# EAGLE design MainBoard (EAGLE 9.6.2)
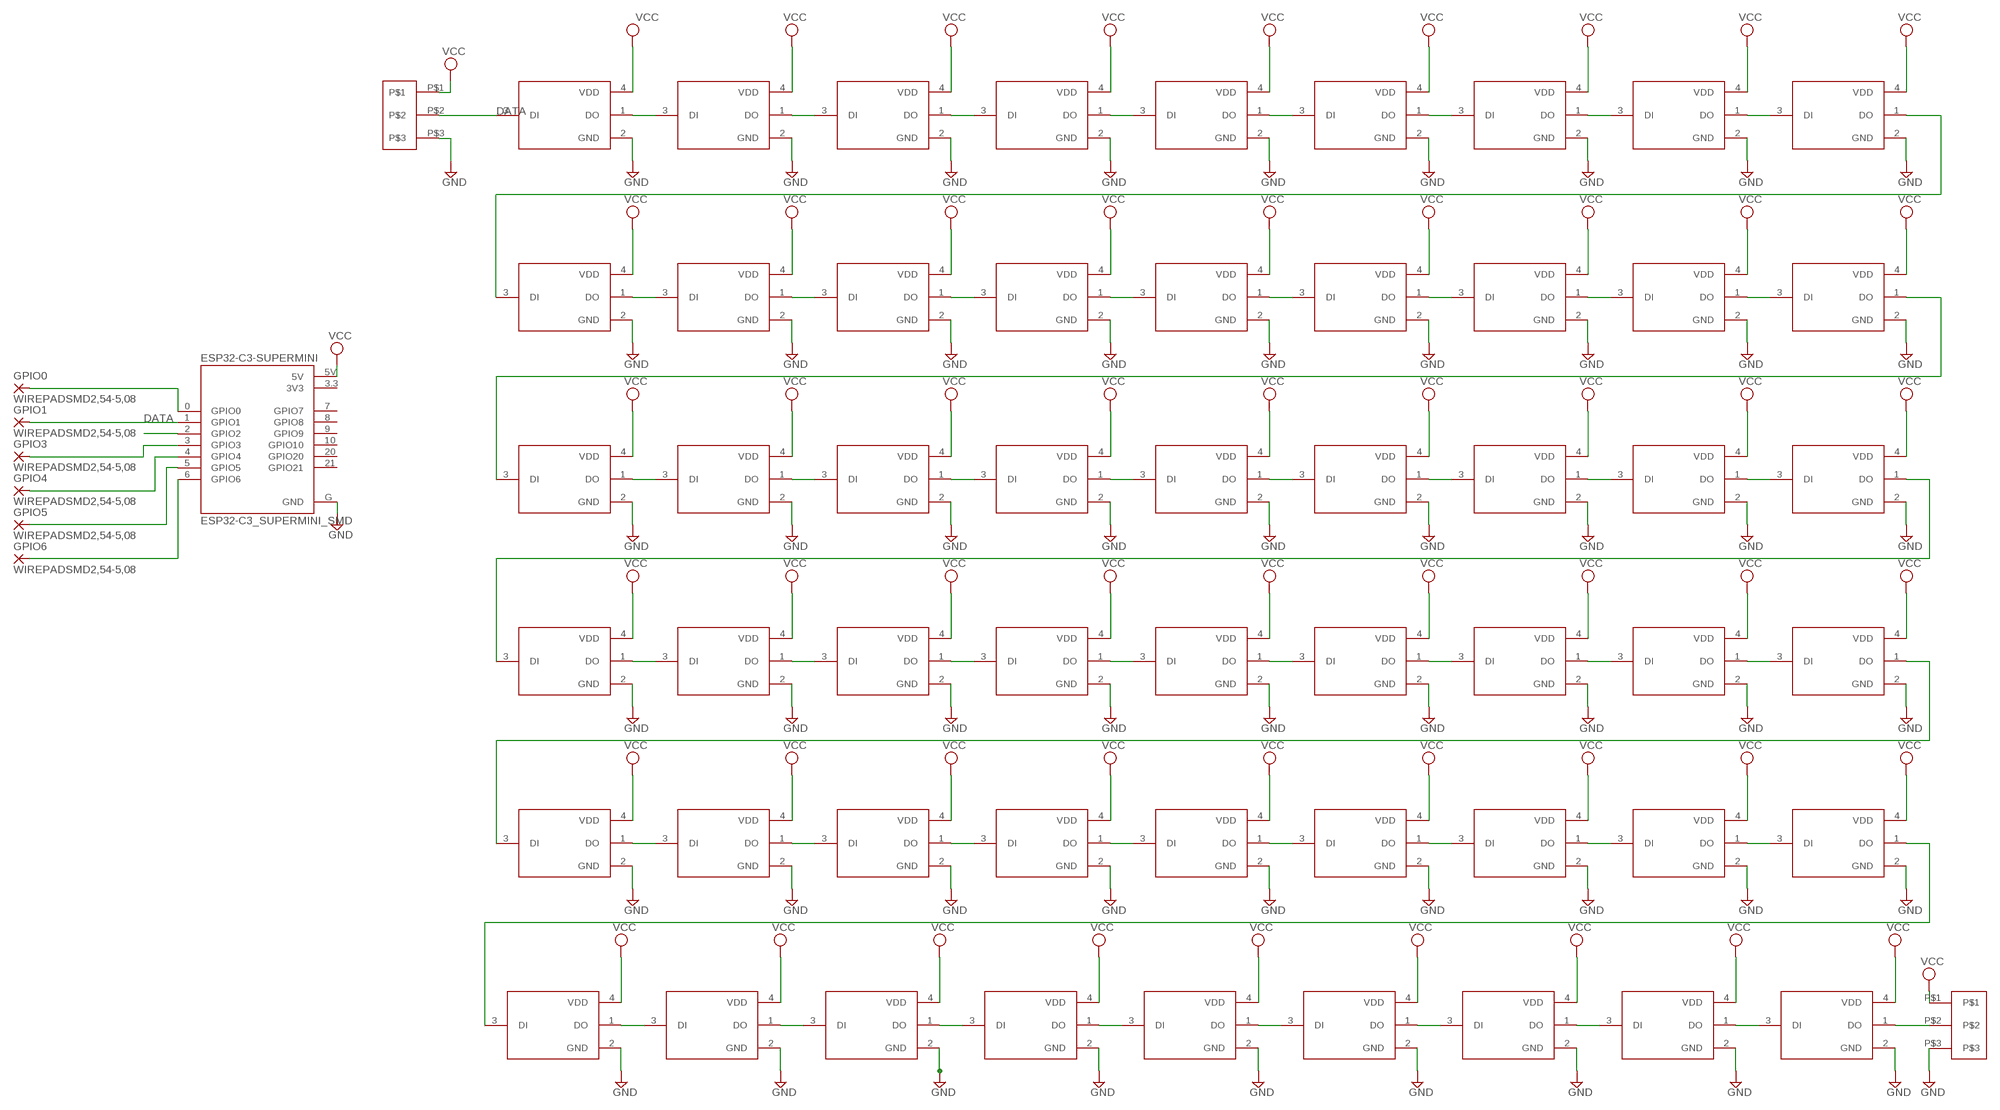
[diagram p0: schematic, sheet 1]

## Parts
ESP32-C3-SUPERMINI  ESP32-C3_SUPERMINI_SMD  [MODULE_ESP32-C3_SUPERMINI]
GPIO0  WIREPADSMD2,54-5,08  [SMD2,54-5,08]
GPIO1  WIREPADSMD2,54-5,08  [SMD2,54-5,08]
GPIO3  WIREPADSMD2,54-5,08  [SMD2,54-5,08]
GPIO4  WIREPADSMD2,54-5,08  [SMD2,54-5,08]
GPIO5  WIREPADSMD2,54-5,08  [SMD2,54-5,08]
GPIO6  WIREPADSMD2,54-5,08  [SMD2,54-5,08]
LED1  WS2812B2020  [LED_WS2812B2020]
LED2  WS2812B2020  [LED_WS2812B2020]
LED3  WS2812B2020  [LED_WS2812B2020]
LED4  WS2812B2020  [LED_WS2812B2020]
LED5  WS2812B2020  [LED_WS2812B2020]
LED6  WS2812B2020  [LED_WS2812B2020]
LED7  WS2812B2020  [LED_WS2812B2020]
LED8  WS2812B2020  [LED_WS2812B2020]
LED9  WS2812B2020  [LED_WS2812B2020]
LED10  WS2812B2020  [LED_WS2812B2020]
LED11  WS2812B2020  [LED_WS2812B2020]
LED12  WS2812B2020  [LED_WS2812B2020]
LED13  WS2812B2020  [LED_WS2812B2020]
LED14  WS2812B2020  [LED_WS2812B2020]
LED15  WS2812B2020  [LED_WS2812B2020]
LED16  WS2812B2020  [LED_WS2812B2020]
LED17  WS2812B2020  [LED_WS2812B2020]
LED18  WS2812B2020  [LED_WS2812B2020]
LED19  WS2812B2020  [LED_WS2812B2020]
LED20  WS2812B2020  [LED_WS2812B2020]
LED21  WS2812B2020  [LED_WS2812B2020]
LED22  WS2812B2020  [LED_WS2812B2020]
LED23  WS2812B2020  [LED_WS2812B2020]
LED24  WS2812B2020  [LED_WS2812B2020]
LED25  WS2812B2020  [LED_WS2812B2020]
LED26  WS2812B2020  [LED_WS2812B2020]
LED27  WS2812B2020  [LED_WS2812B2020]
LED28  WS2812B2020  [LED_WS2812B2020]
LED29  WS2812B2020  [LED_WS2812B2020]
LED30  WS2812B2020  [LED_WS2812B2020]
LED31  WS2812B2020  [LED_WS2812B2020]
LED32  WS2812B2020  [LED_WS2812B2020]
LED33  WS2812B2020  [LED_WS2812B2020]
LED34  WS2812B2020  [LED_WS2812B2020]
LED35  WS2812B2020  [LED_WS2812B2020]
LED36  WS2812B2020  [LED_WS2812B2020]
LED37  WS2812B2020  [LED_WS2812B2020]
LED38  WS2812B2020  [LED_WS2812B2020]
LED39  WS2812B2020  [LED_WS2812B2020]
LED40  WS2812B2020  [LED_WS2812B2020]
LED41  WS2812B2020  [LED_WS2812B2020]
LED42  WS2812B2020  [LED_WS2812B2020]
LED43  WS2812B2020  [LED_WS2812B2020]
LED44  WS2812B2020  [LED_WS2812B2020]
LED45  WS2812B2020  [LED_WS2812B2020]
LED46  WS2812B2020  [LED_WS2812B2020]
LED47  WS2812B2020  [LED_WS2812B2020]
LED48  WS2812B2020  [LED_WS2812B2020]
LED49  WS2812B2020  [LED_WS2812B2020]
LED50  WS2812B2020  [LED_WS2812B2020]
LED51  WS2812B2020  [LED_WS2812B2020]
LED52  WS2812B2020  [LED_WS2812B2020]
LED53  WS2812B2020  [LED_WS2812B2020]
LED54  WS2812B2020  [LED_WS2812B2020]
U$1  POGO-3-M  [POGO-3-M]
U$2  POGO-3-F  [POGO-3-F]

## Nets
DATA: ESP32-C3-SUPERMINI.2(GPIO2) LED1.3(DI) U$2.P$2
GND: ESP32-C3-SUPERMINI.G(GND) LED1.2(GND) LED2.2(GND) LED3.2(GND) LED4.2(GND) LED5.2(GND) LED6.2(GND) LED7.2(GND) LED8.2(GND) LED9.2(GND) LED10.2(GND) LED11.2(GND) LED12.2(GND) LED13.2(GND) LED14.2(GND) LED15.2(GND) LED16.2(GND) LED17.2(GND) LED18.2(GND) LED19.2(GND) LED20.2(GND) LED21.2(GND) LED22.2(GND) LED23.2(GND) LED24.2(GND) LED25.2(GND) LED26.2(GND) LED27.2(GND) LED28.2(GND) LED29.2(GND) LED30.2(GND) LED31.2(GND) LED32.2(GND) LED33.2(GND) LED34.2(GND) LED35.2(GND) LED36.2(GND) LED37.2(GND) LED38.2(GND) LED39.2(GND) LED40.2(GND) LED41.2(GND) LED42.2(GND) LED43.2(GND) LED44.2(GND) LED45.2(GND) LED46.2(GND) LED47.2(GND) LED48.2(GND) LED49.2(GND) LED50.2(GND) LED51.2(GND) LED52.2(GND) LED53.2(GND) LED54.2(GND) U$1.P$3 U$2.P$3
N$1: LED1.1(DO) LED2.3(DI)
N$2: LED2.1(DO) LED3.3(DI)
N$3: LED3.1(DO) LED4.3(DI)
N$4: LED4.1(DO) LED5.3(DI)
N$5: LED5.1(DO) LED6.3(DI)
N$6: LED6.1(DO) LED7.3(DI)
N$7: LED7.1(DO) LED8.3(DI)
N$8: LED8.1(DO) LED9.3(DI)
N$9: LED9.1(DO) LED10.3(DI)
N$10: LED10.1(DO) LED11.3(DI)
N$11: LED11.1(DO) LED12.3(DI)
N$12: LED12.1(DO) LED13.3(DI)
N$13: LED13.1(DO) LED14.3(DI)
N$14: LED14.1(DO) LED15.3(DI)
N$15: LED15.1(DO) LED16.3(DI)
N$16: LED16.1(DO) LED17.3(DI)
N$17: LED17.1(DO) LED18.3(DI)
N$18: LED18.1(DO) LED19.3(DI)
N$19: LED19.1(DO) LED20.3(DI)
N$20: LED20.1(DO) LED21.3(DI)
N$21: LED21.1(DO) LED22.3(DI)
N$22: LED22.1(DO) LED23.3(DI)
N$23: LED23.1(DO) LED24.3(DI)
N$24: LED24.1(DO) LED25.3(DI)
N$25: LED25.1(DO) LED26.3(DI)
N$26: LED26.1(DO) LED27.3(DI)
N$27: LED27.1(DO) LED28.3(DI)
N$28: LED28.1(DO) LED29.3(DI)
N$29: LED29.1(DO) LED30.3(DI)
N$30: LED30.1(DO) LED31.3(DI)
N$31: LED31.1(DO) LED32.3(DI)
N$32: LED32.1(DO) LED33.3(DI)
N$33: LED33.1(DO) LED34.3(DI)
N$34: LED34.1(DO) LED35.3(DI)
N$35: LED35.1(DO) LED36.3(DI)
N$36: LED36.1(DO) LED37.3(DI)
N$37: LED37.1(DO) LED38.3(DI)
N$38: LED38.1(DO) LED39.3(DI)
N$39: LED39.1(DO) LED40.3(DI)
N$40: LED40.1(DO) LED41.3(DI)
N$41: LED41.1(DO) LED42.3(DI)
N$42: LED42.1(DO) LED43.3(DI)
N$43: LED43.1(DO) LED44.3(DI)
N$44: LED44.1(DO) LED45.3(DI)
N$45: LED45.1(DO) LED46.3(DI)
N$46: LED46.1(DO) LED47.3(DI)
N$47: LED47.1(DO) LED48.3(DI)
N$48: LED48.1(DO) LED49.3(DI)
N$49: LED49.1(DO) LED50.3(DI)
N$50: LED50.1(DO) LED51.3(DI)
N$51: LED51.1(DO) LED52.3(DI)
N$52: LED52.1(DO) LED53.3(DI)
N$53: LED53.1(DO) LED54.3(DI)
N$54: LED54.1(DO) U$1.P$2
N$55: ESP32-C3-SUPERMINI.0(GPIO0) GPIO0.1(P)
N$56: ESP32-C3-SUPERMINI.1(GPIO1) GPIO1.1(P)
N$57: ESP32-C3-SUPERMINI.6(GPIO6) GPIO6.1(P)
N$58: ESP32-C3-SUPERMINI.5(GPIO5) GPIO5.1(P)
N$59: ESP32-C3-SUPERMINI.4(GPIO4) GPIO4.1(P)
N$60: ESP32-C3-SUPERMINI.3(GPIO3) GPIO3.1(P)
VCC: ESP32-C3-SUPERMINI.5V LED1.4(VDD) LED2.4(VDD) LED3.4(VDD) LED4.4(VDD) LED5.4(VDD) LED6.4(VDD) LED7.4(VDD) LED8.4(VDD) LED9.4(VDD) LED10.4(VDD) LED11.4(VDD) LED12.4(VDD) LED13.4(VDD) LED14.4(VDD) LED15.4(VDD) LED16.4(VDD) LED17.4(VDD) LED18.4(VDD) LED19.4(VDD) LED20.4(VDD) LED21.4(VDD) LED22.4(VDD) LED23.4(VDD) LED24.4(VDD) LED25.4(VDD) LED26.4(VDD) LED27.4(VDD) LED28.4(VDD) LED29.4(VDD) LED30.4(VDD) LED31.4(VDD) LED32.4(VDD) LED33.4(VDD) LED34.4(VDD) LED35.4(VDD) LED36.4(VDD) LED37.4(VDD) LED38.4(VDD) LED39.4(VDD) LED40.4(VDD) LED41.4(VDD) LED42.4(VDD) LED43.4(VDD) LED44.4(VDD) LED45.4(VDD) LED46.4(VDD) LED47.4(VDD) LED48.4(VDD) LED49.4(VDD) LED50.4(VDD) LED51.4(VDD) LED52.4(VDD) LED53.4(VDD) LED54.4(VDD) U$1.P$1 U$2.P$1
Unconnected: ESP32-C3-SUPERMINI.7(GPIO7) ESP32-C3-SUPERMINI.8(GPIO8) ESP32-C3-SUPERMINI.9(GPIO9) ESP32-C3-SUPERMINI.10(GPIO10) ESP32-C3-SUPERMINI.20(GPIO20) ESP32-C3-SUPERMINI.21(GPIO21)

## Power pins joined to a net without a drawn wire
3V3: ESP32-C3-SUPERMINI.3.3(3V3)

## Library data of the parts
ESP32-C3-SUPERMINI = ESP32-C3_SUPERMINI_SMD:ESP32-C3_SUPERMINI_SMD: Check availability <https://pricing.snapeda.com/parts/ESP32-C3%20SuperMini_SMD/Espressif%20Systems/view-part?ref=eda>; AVAILABILITY: Not in stock; CHECK_PRICES: https://www.snapeda.com/parts/ESP32-C3%20SuperMini_SMD/Espressif+Systems/view-part/?ref=eda; DESCRIPTION: Super tiny ESP32-C3 board; MF: Espressif Systems; MP: ESP32-C3 SuperMini_SMD; PACKAGE: None; PRICE: None; SNAPEDA_LINK: https://www.snapeda.com/parts/ESP32-C3%20SuperMini_SMD/Espressif+Systems/view-part/?ref=snap
GPIO0 GPIO1 GPIO3-GPIO6 = wirepad:WIREPAD: Wire PAD connect wire on PCB
LED1-LED54 = WS2812B2020:WS2812B2020: Check availability <https://pricing.snapeda.com/parts/WS2812B2020/WorldSemi/view-part?ref=eda>; AVAILABILITY: Not in stock; CHECK_PRICES: https://www.snapeda.com/parts/WS2812B2020/Worldsemi/view-part/?ref=eda; DESCRIPTION: LED; SMD; 2020; RGB; 2x2x0.84mm; 3.7÷5.3V; Lens: transparent; 2kHz; MF: WorldSemi; MP: WS2812B2020; PACKAGE: None; PRICE: None; SNAPEDA_LINK: https://www.snapeda.com/parts/WS2812B2020/Worldsemi/view-part/?ref=snap
U$1 = untitled:POGO-3-M
U$2 = untitled:POGO-3-F

## Board
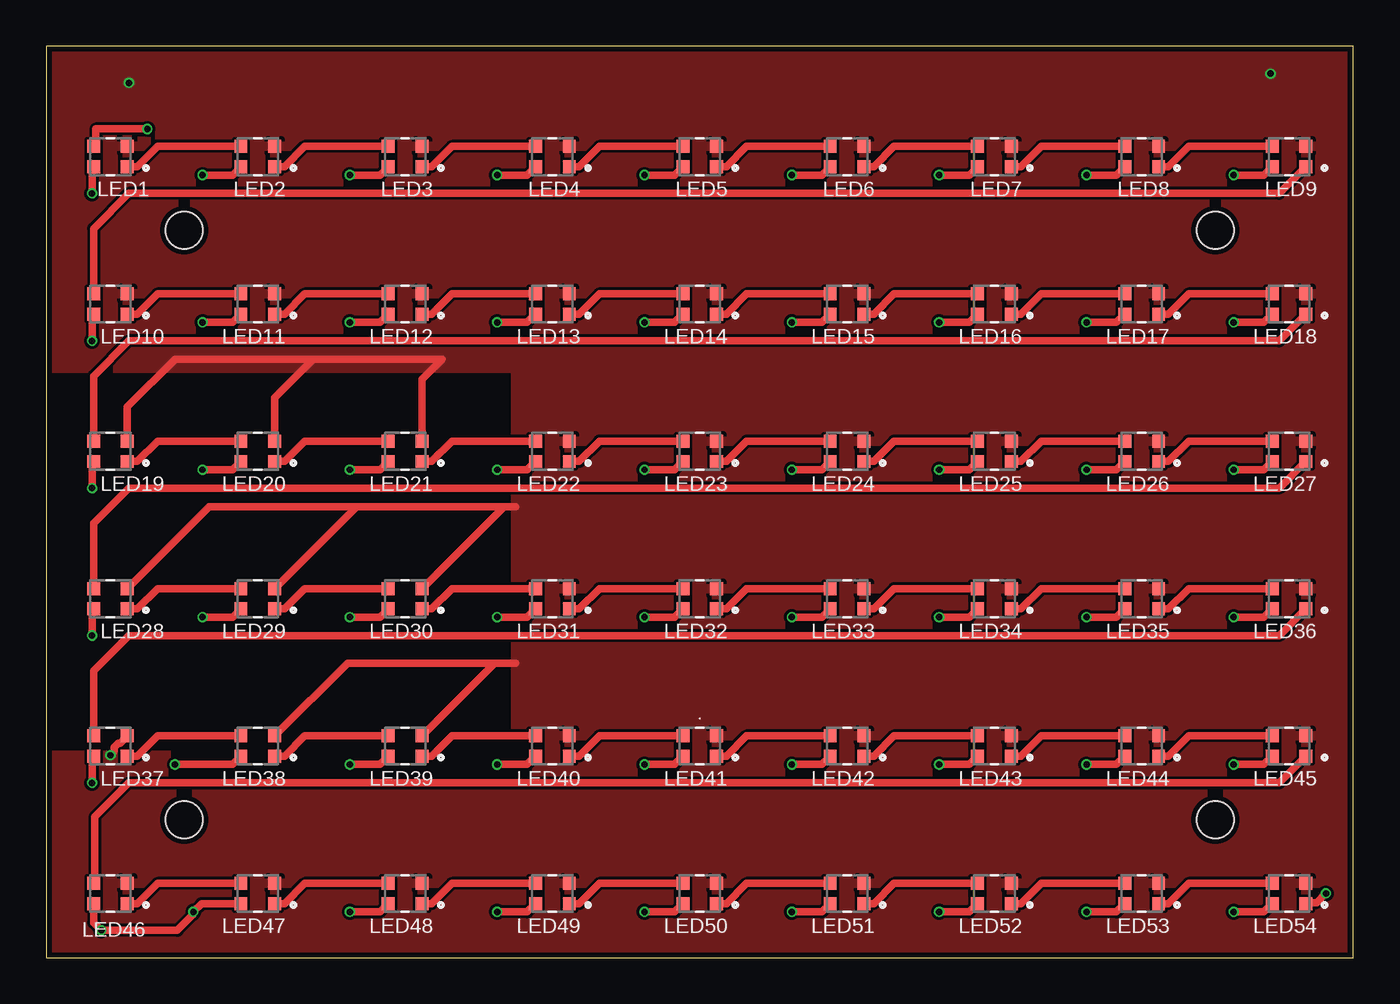
[diagram p1: board, top side]
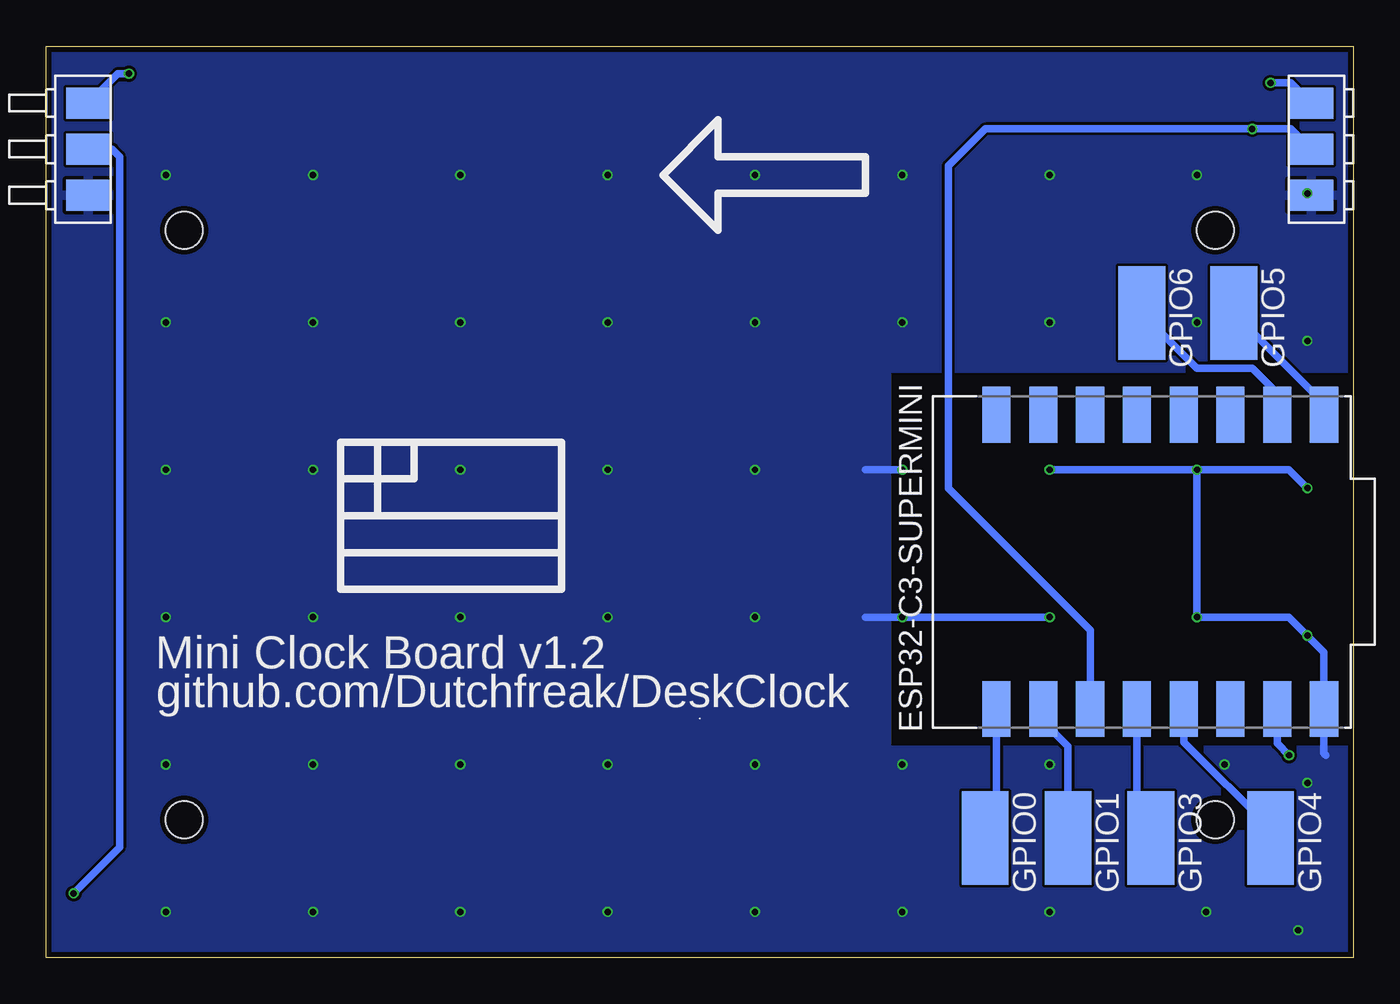
[diagram p2: board, bottom side, seen from below]

Size 71 x 49.5 mm. Coordinates in mm from the lower left corner, seen from the top.
Outline: 0,0 71,0 71,49.5 0,49.5 0,0
Copper layers (1*16): Top 0.035mm / dielectric 1.5mm / Bottom 0.035mm
Design rules "PCBWay_2L_152um-Track": minimum track width 6mil, minimum drill 0.3mm, track to track 6mil, track to pad 6mil, pad to pad 6mil, via to via 6mil, smd to smd 0mil, copper to edge 0.3mm, drill to drill 10mil, minimum pad ring 6mil, minimum via ring 0.1mm, stop-mask expansion 2mil, vias tented up to drill 0.45mm, thermal gap 0.2mm
Holes 2 mm at 7.5,39.5 7.5,7.5 63.5,7.5 63.5,39.5

### Footprints (pad centres in the part's own frame; a part is rotated, then mirrored left to right if it is on the bottom)
MODULE_ESP32-C3_SUPERMINI = smd 3.025 x 1.524: 0 7.985,-7.88; 1 7.985,-5.34; 2 7.985,-2.8; 3 7.985,-0.26; 3.3 7.985,4.82; 4 7.985,2.28; 5 -7.985,9.9; 5V 7.985,9.9; 6 -7.985,7.36; 7 -7.985,4.82; 8 -7.985,2.28; 9 -7.985,-0.26; 10 -7.985,-2.8; 20 -7.985,-5.34; 21 -7.985,-7.88; G 7.985,7.36
SMD2,54-5,08 = smd 2.54 x 5.08: 1 0,0
LED_WS2812B2020 = smd 0.7 x 0.7: 1 -0.915,0.55; 2 -0.915,-0.55; 3 0.915,-0.55; 4 0.915,0.55
POGO-3-M = smd 2.4 x 1.7: P$1 0,2.5; P$2 0,0; P$3 0,-2.5
POGO-3-F = smd 2.4 x 1.7: P$1 0,2.5; P$2 0,0; P$3 0,-2.5

### Placement (x,y rotation side)
ESP32-C3-SUPERMINI  11.5,21.5 270 bottom
GPIO0  20,6.5 180 bottom
GPIO1  15.5,6.5 180 bottom
GPIO3  11,6.5 180 bottom
GPIO4  4.5,6.5 180 bottom
GPIO5  6.5,35 180 bottom
GPIO6  11.5,35 180 bottom
LED1  3.5,43.5 180 top
LED2  11.5,43.5 180 top
LED3  19.5,43.5 180 top
LED4  27.5,43.5 180 top
LED5  35.5,43.5 180 top
LED6  43.5,43.5 180 top
LED7  51.5,43.5 180 top
LED8  59.5,43.5 180 top
LED9  67.5,43.5 180 top
LED10  3.5,35.5 180 top
LED11  11.5,35.5 180 top
LED12  19.5,35.5 180 top
LED13  27.5,35.5 180 top
LED14  35.5,35.5 180 top
LED15  43.5,35.5 180 top
LED16  51.5,35.5 180 top
LED17  59.5,35.5 180 top
LED18  67.5,35.5 180 top
LED19  3.5,27.5 180 top
LED20  11.5,27.5 180 top
LED21  19.5,27.5 180 top
LED22  27.5,27.5 180 top
LED23  35.5,27.5 180 top
LED24  43.5,27.5 180 top
LED25  51.5,27.5 180 top
LED26  59.5,27.5 180 top
LED27  67.5,27.5 180 top
LED28  3.5,19.5 180 top
LED29  11.5,19.5 180 top
LED30  19.5,19.5 180 top
LED31  27.5,19.5 180 top
LED32  35.5,19.5 180 top
LED33  43.5,19.5 180 top
LED34  51.5,19.5 180 top
LED35  59.5,19.5 180 top
LED36  67.5,19.5 180 top
LED37  3.5,11.5 180 top
LED38  11.5,11.5 180 top
LED39  19.5,11.5 180 top
LED40  27.5,11.5 180 top
LED41  35.5,11.5 180 top
LED42  43.5,11.5 180 top
LED43  51.5,11.5 180 top
LED44  59.5,11.5 180 top
LED45  67.5,11.5 180 top
LED46  3.5,3.5 180 top
LED47  11.5,3.5 180 top
LED48  19.5,3.5 180 top
LED49  27.5,3.5 180 top
LED50  35.5,3.5 180 top
LED51  43.5,3.5 180 top
LED52  51.5,3.5 180 top
LED53  59.5,3.5 180 top
LED54  67.5,3.5 180 top
U$1  68.7,43.9 180 bottom
U$2  2.3,43.9 180 bottom

### Tracks (layer width: path | path; a pad name or v marks a point on that pad's centre or on a via)
DATA  (via drill 0.35)
  Top 0.406: LED1.3 2.7,44.17 2.7,45 v5.5,45
  Bottom 0.406: ESP32-C3-SUPERMINI.2 14.3,17.8 22,25.5 22,43 20,45 v5.5,45 3.4,45 U$2.P$2 2.3,44.49
GND  (via drill 0.35)
  Top 0.406: LED19.2 4.41,29.91 7,32.5 14.5,32.5 | 14.5,32.5 21.5,32.5 20.41,31.41 LED21.2 | LED20.2 12.41,30.41 14.5,32.5 | LED28.2 8.87,24.5 16.86,24.5 | 24.86,24.5 16.86,24.5 | LED29.2 16.86,24.5 | LED30.2 24.86,24.5 | 24.86,24.5 25.5,24.5 | v3.5,11 3.71,11.21 3.71,11.45 3.92,11.66 4.02,11.66 LED37.2 | LED38.2 16.36,16 24.36,16 | LED39.2 24.36,16 | 24.36,16 25.5,16
  Bottom 0.406: U$2.P$3 3.4,47.5 v4.5,47.5 | U$1.P$3 67.1,48 v66.5,48 | ESP32-C3-SUPERMINI.G 4.14,11.64 v3.5,11
  pour Top: 0,49.5 71,49.5 71,0 0,0 0,11 25.5,11 25.5,32 0,32
N$1
  Top 0.406: 10.65,44.11 LED2.3 6.05,44.05 4.95,42.95 LED1.1
N$2
  Top 0.406: LED3.3 14.05,44.05 12.95,42.95 LED2.1
N$3
  Top 0.406: 26.65,44.11 LED4.3 22.05,44.05 20.95,42.95 LED3.1
N$4
  Top 0.406: 34.65,44.11 LED5.3 30.05,44.05 28.95,42.95 LED4.1
N$5
  Top 0.406: 42.65,44.11 LED6.3 38.05,44.05 36.95,42.95 LED5.1
N$6
  Top 0.406: 50.65,44.11 LED7.3 46.05,44.05 44.95,42.95 LED6.1
N$7
  Top 0.406: LED8.3 54.05,44.05 52.95,42.95 LED7.1
N$8
  Top 0.406: LED9.3 66.5,44.05 62.05,44.05 60.95,42.95 LED8.1
N$9
  Top 0.406: LED9.1 66.97,41.5 4.5,41.5 2.58,39.58 LED10.3
N$10
  Top 0.406: LED11.3 6.05,36.05 4.95,34.95 LED10.1
N$11
  Top 0.406: LED12.3 14.05,36.05 12.95,34.95 LED11.1
N$12
  Top 0.406: LED13.3 22.05,36.05 20.95,34.95 LED12.1
N$13
  Top 0.406: LED14.3 30.05,36.05 28.95,34.95 LED13.1
N$14
  Top 0.406: LED15.3 38.05,36.05 36.95,34.95 LED14.1
N$15
  Top 0.406: LED16.3 46.05,36.05 44.95,34.95 LED15.1
N$16
  Top 0.406: LED17.3 54.05,36.05 52.95,34.95 LED16.1
N$17
  Top 0.406: LED18.3 62.05,36.05 60.95,34.95 LED17.1
N$18
  Top 0.406: LED18.1 66.97,33.5 4.5,33.5 2.58,31.59 LED19.3
N$19
  Top 0.406: LED20.3 6.05,28.05 4.95,26.95 LED19.1
N$20
  Top 0.406: LED21.3 14.05,28.05 12.95,26.95 LED20.1
N$21
  Top 0.406: LED22.3 22.05,28.05 20.95,26.95 LED21.1
N$22
  Top 0.406: LED23.3 30.05,28.05 28.95,26.95 LED22.1
N$23
  Top 0.406: LED24.3 38.05,28.05 36.95,26.95 LED23.1
N$24
  Top 0.406: LED25.3 46.05,28.05 44.95,26.95 LED24.1
N$25
  Top 0.406: LED26.3 54.05,28.05 52.95,26.95 LED25.1
N$26
  Top 0.406: LED27.3 62.05,28.05 60.95,26.95 LED26.1
N$27
  Top 0.406: LED27.1 66.97,25.5 4.5,25.5 2.58,23.59 LED28.3
N$28
  Top 0.406: LED29.3 6.05,20.05 4.95,18.95 LED28.1
N$29
  Top 0.406: LED30.3 14.05,20.05 12.95,18.95 LED29.1
N$30
  Top 0.406: LED31.3 22.05,20.05 20.95,18.95 LED30.1
N$31
  Top 0.406: LED32.3 30.05,20.05 28.95,18.95 LED31.1
N$32
  Top 0.406: LED33.3 38.05,20.05 36.95,18.95 LED32.1
N$33
  Top 0.406: LED34.3 46.05,20.05 44.95,18.95 LED33.1
N$34
  Top 0.406: LED35.3 54.05,20.05 52.95,18.95 LED34.1
N$35
  Top 0.406: LED36.3 62.05,20.05 60.95,18.95 LED35.1
N$36
  Top 0.406: LED36.1 66.97,17.5 4.5,17.5 2.58,15.59 LED37.3
N$37
  Top 0.406: LED38.3 6.05,12.05 4.95,10.95 LED37.1
N$38
  Top 0.406: LED39.3 14.05,12.05 12.95,10.95 LED38.1
N$39
  Top 0.406: LED40.3 22.05,12.05 20.95,10.95 LED39.1
N$40
  Top 0.406: 34.65,12.12 LED41.3 30.05,12.05 28.95,10.95 LED40.1
N$41
  Top 0.406: LED42.3 38.05,12.05 36.95,10.95 LED41.1
N$42
  Top 0.406: LED43.3 46.05,12.05 44.95,10.95 LED42.1
N$43
  Top 0.406: LED44.3 54.05,12.05 52.95,10.95 LED43.1
N$44
  Top 0.406: LED45.3 62.05,12.05 60.95,10.95 LED44.1
N$45
  Top 0.406: LED45.1 66.97,9.5 4.5,9.5 2.65,7.65 2.65,4.12 LED46.3
N$46
  Top 0.406: LED47.3 6.05,4.05 4.95,2.95 LED46.1
N$47
  Top 0.406: LED48.3 14.05,4.05 12.95,2.95 LED47.1
N$48
  Top 0.406: LED49.3 22.05,4.05 20.95,2.95 LED48.1
N$49
  Top 0.406: LED50.3 30.05,4.05 28.95,2.95 LED49.1
N$50
  Top 0.406: LED51.3 38.05,4.05 36.95,2.95 LED50.1
N$51
  Top 0.406: LED52.3 46.05,4.05 44.95,2.95 LED51.1
N$52
  Top 0.406: LED53.3 54.05,4.05 52.95,2.95 LED52.1
N$53
  Top 0.406: LED54.3 62.05,4.05 60.95,2.95 LED53.1
N$54  (via drill 0.35)
  Top 0.406: LED54.1 68.47,3 69,3 v69.5,3.5
  Bottom 0.406: U$1.P$2 67.4,43.9 67,43.5 67,6 v69.5,3.5
N$55
  Bottom 0.406: ESP32-C3-SUPERMINI.0 19.38,7.12 GPIO0.1
N$56
  Bottom 0.406: ESP32-C3-SUPERMINI.1 16.84,12.84 15.5,11.5 GPIO1.1
N$57
  Bottom 0.406: ESP32-C3-SUPERMINI.6 4.14,30.64 5.5,32 8.5,32 GPIO6.1
N$58
  Bottom 0.406: ESP32-C3-SUPERMINI.5 1.6,30.1 GPIO5.1
N$59
  Bottom 0.406: ESP32-C3-SUPERMINI.4 9.22,11.72 4.5,7 GPIO4.1
N$60
  Bottom 0.406: ESP32-C3-SUPERMINI.3 11.76,7.26 GPIO3.1
VCC  (via drill 0.35)
  Top 0.406: LED1.4 2.5,42.86 v2.5,41.5 | LED2.4 10.13,42.5 v8.5,42.5 | LED3.4 18.14,42.5 v16.5,42.5 | LED4.4 26.14,42.5 v24.5,42.5 | LED5.4 34.13,42.5 v32.5,42.5 | LED6.4 42.13,42.5 v40.5,42.5 | LED7.4 50.13,42.5 v48.5,42.5 | LED8.4 58.13,42.5 v56.5,42.5 | LED9.4 66.14,42.5 v64.5,42.5 | LED10.4 2.5,34.87 v2.5,33.5 | LED11.4 10.13,34.5 v8.5,34.5 | LED12.4 18.14,34.5 v16.5,34.5 | LED13.4 26.14,34.5 v24.5,34.5 | LED14.4 34.13,34.5 v32.5,34.5 | LED15.4 42.13,34.5 v40.5,34.5 | LED16.4 50.13,34.5 v48.5,34.5 | LED17.4 58.13,34.5 v56.5,34.5 | LED18.4 66.14,34.5 v64.5,34.5 | LED19.4 2.5,26.87 v2.5,25.5 | LED20.4 10.13,26.5 v8.5,26.5 | LED21.4 18.14,26.5 v16.5,26.5 | LED22.4 26.14,26.5 v24.5,26.5 | LED23.4 34.13,26.5 v32.5,26.5 | LED24.4 42.13,26.5 v40.5,26.5 | LED25.4 50.13,26.5 v48.5,26.5 | LED26.4 58.13,26.5 v56.5,26.5 | LED27.4 66.14,26.5 v64.5,26.5 | LED28.4 2.5,18.87 v2.5,17.5 | LED29.4 10.13,18.5 v8.5,18.5 | LED30.4 18.14,18.5 v16.5,18.5 | LED31.4 26.14,18.5 v24.5,18.5 | LED32.4 34.13,18.5 v32.5,18.5 | LED33.4 42.13,18.5 v40.5,18.5 | LED34.4 50.13,18.5 v48.5,18.5 | LED35.4 58.13,18.5 v56.5,18.5 | LED36.4 66.14,18.5 v64.5,18.5 | LED37.4 2.5,10.87 v2.5,9.5 | LED38.4 10.13,10.5 v7,10.5 | LED39.4 18.14,10.5 v16.5,10.5 | LED40.4 26.14,10.5 v24.5,10.5 | LED41.4 34.13,10.5 v32.5,10.5 | LED42.4 42.13,10.5 v40.5,10.5 | LED43.4 50.13,10.5 v48.5,10.5 | LED44.4 58.13,10.5 v56.5,10.5 | LED45.4 66.14,10.5 v64.5,10.5 | LED54.4 66.14,2.5 v64.5,2.5 | LED53.4 58.13,2.5 v56.5,2.5 | LED52.4 50.13,2.5 v48.5,2.5 | LED51.4 42.13,2.5 v40.5,2.5 | LED50.4 34.13,2.5 v32.5,2.5 | LED49.4 26.14,2.5 v24.5,2.5 | LED48.4 18.14,2.5 v16.5,2.5 | LED46.4 2.58,1.91 v3,1.5 7.13,1.5 8,2.36 v8,2.5 8.45,2.95 LED47.4
  Bottom 0.406: v8.5,26.5 v16.5,26.5 | v8.5,26.5 v8.5,18.5 3.5,18.5 v2.5,17.5 1.6,16.6 ESP32-C3-SUPERMINI.5V 1.6,11.1 1.5,11 | v24.5,26.5 26.5,26.5 | v2.5,25.5 3.5,26.5 v8.5,26.5 | v16.5,18.5 v24.5,18.5 26.5,18.5
  pour Bottom: 0,49.5 71,49.5 71,0 0,0 0,11.28 25.38,11.28 25.38,32 0,32

### Text on the board
bPlace: Mini Clock Board v1.2 | github.com/Dutchfreak/DeskClock